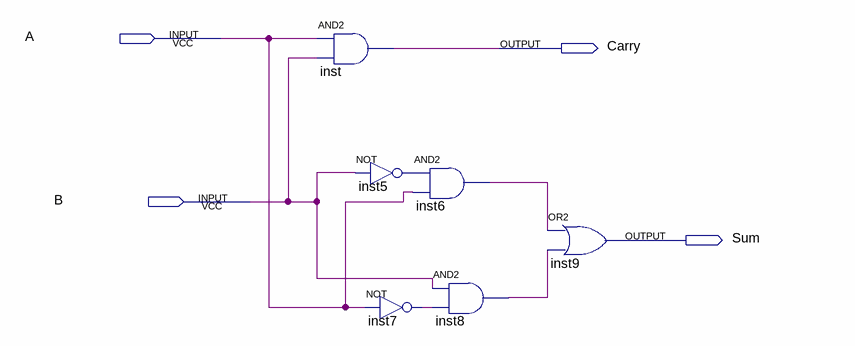
[diagram p0: schematic sheet]
// Quartus schematic halfadder.bdf as structural Verilog: 6 symbols, 4 pins
module halfadder (
  input  A,
  input  B,
  output Carry,
  output Sum
);

  wire inst5_out, inst6_out, inst7_out, inst8_out;

  and inst (Carry, A, B);
  not inst5 (inst5_out, B);
  not inst7 (inst7_out, A);
  and inst6 (inst6_out, inst5_out, A);
  and inst8 (inst8_out, B, inst7_out);
  or inst9 (Sum, inst6_out, inst8_out);
endmodule
